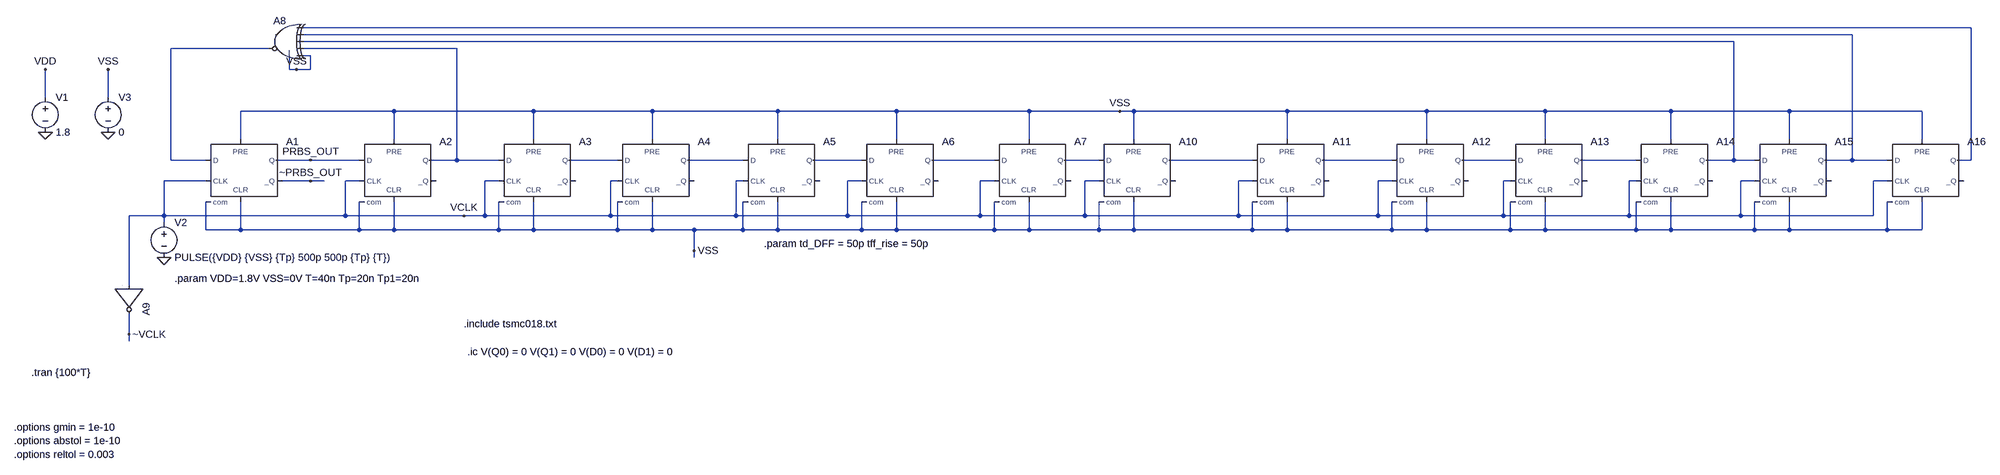
[diagram p0: schematic PRBS14bit.asc]
PRBS14bit.asc, the LTspice schematic file:
Version 4
SHEET 1 3508 752
WIRE 2880 -256 -944 -256
WIRE 2608 -240 -944 -240
WIRE 2336 -224 -944 -224
WIRE -1024 -208 -1248 -208
WIRE -592 -208 -944 -208
WIRE -928 -192 -944 -192
WIRE -976 -160 -976 -192
WIRE -960 -160 -976 -160
WIRE -928 -160 -928 -192
WIRE -928 -160 -960 -160
WIRE -1536 -96 -1536 -160
WIRE -1392 -96 -1392 -160
WIRE -736 -64 -1088 -64
WIRE -416 -64 -736 -64
WIRE -144 -64 -416 -64
WIRE 144 -64 -144 -64
WIRE 416 -64 144 -64
WIRE 720 -64 416 -64
WIRE 928 -64 720 -64
WIRE 960 -64 928 -64
WIRE 1312 -64 960 -64
WIRE 1632 -64 1312 -64
WIRE 1904 -64 1632 -64
WIRE 2192 -64 1904 -64
WIRE 2464 -64 2192 -64
WIRE 2768 -64 2464 -64
WIRE -1088 0 -1088 -64
WIRE -736 0 -736 -64
WIRE -416 0 -416 -64
WIRE -144 0 -144 -64
WIRE 144 0 144 -64
WIRE 416 0 416 -64
WIRE 720 0 720 -64
WIRE 960 0 960 -64
WIRE 1312 0 1312 -64
WIRE 1632 0 1632 -64
WIRE 1904 0 1904 -64
WIRE 2192 0 2192 -64
WIRE 2464 0 2464 -64
WIRE 2768 0 2768 -64
WIRE -1248 48 -1248 -208
WIRE -1168 48 -1248 48
WIRE -928 48 -1008 48
WIRE -816 48 -928 48
WIRE -592 48 -592 -208
WIRE -592 48 -656 48
WIRE -496 48 -592 48
WIRE -224 48 -336 48
WIRE 64 48 -64 48
WIRE 336 48 224 48
WIRE 640 48 496 48
WIRE 880 48 800 48
WIRE 1232 48 1040 48
WIRE 1552 48 1392 48
WIRE 1824 48 1712 48
WIRE 2112 48 1984 48
WIRE 2336 48 2336 -224
WIRE 2336 48 2272 48
WIRE 2384 48 2336 48
WIRE 2608 48 2608 -240
WIRE 2608 48 2544 48
WIRE 2688 48 2608 48
WIRE 2880 48 2880 -256
WIRE 2880 48 2848 48
WIRE -1168 96 -1264 96
WIRE -928 96 -992 96
WIRE -896 96 -928 96
WIRE -816 96 -848 96
WIRE -496 96 -528 96
WIRE -224 96 -240 96
WIRE 64 96 48 96
WIRE 336 96 304 96
WIRE 640 96 608 96
WIRE 880 96 848 96
WIRE 1232 96 1200 96
WIRE 1552 96 1520 96
WIRE 1824 96 1808 96
WIRE 2112 96 2096 96
WIRE 2384 96 2352 96
WIRE 2688 96 2656 96
WIRE -1264 176 -1264 96
WIRE -1264 176 -1344 176
WIRE -848 176 -848 96
WIRE -848 176 -1264 176
WIRE -576 176 -848 176
WIRE -528 176 -528 96
WIRE -528 176 -576 176
WIRE -240 176 -240 96
WIRE -240 176 -528 176
WIRE 48 176 48 96
WIRE 48 176 -240 176
WIRE 304 176 304 96
WIRE 304 176 48 176
WIRE 608 176 608 96
WIRE 608 176 304 176
WIRE 848 176 848 96
WIRE 848 176 608 176
WIRE 1200 176 1200 96
WIRE 1200 176 848 176
WIRE 1520 176 1520 96
WIRE 1520 176 1200 176
WIRE 1808 176 1808 96
WIRE 1808 176 1520 176
WIRE 2096 176 2096 96
WIRE 2096 176 1808 176
WIRE 2352 176 2352 96
WIRE 2352 176 2096 176
WIRE 2656 176 2656 96
WIRE 2656 176 2352 176
WIRE -1264 192 -1264 176
WIRE -1168 208 -1168 144
WIRE -1088 208 -1088 144
WIRE -1088 208 -1168 208
WIRE -816 208 -816 144
WIRE -816 208 -1088 208
WIRE -736 208 -736 144
WIRE -736 208 -816 208
WIRE -496 208 -496 144
WIRE -496 208 -736 208
WIRE -416 208 -416 144
WIRE -416 208 -496 208
WIRE -224 208 -224 144
WIRE -224 208 -416 208
WIRE -144 208 -144 144
WIRE -144 208 -224 208
WIRE -48 208 -144 208
WIRE 64 208 64 144
WIRE 64 208 -48 208
WIRE 144 208 144 144
WIRE 144 208 64 208
WIRE 336 208 336 144
WIRE 336 208 144 208
WIRE 416 208 416 144
WIRE 416 208 336 208
WIRE 640 208 640 144
WIRE 640 208 416 208
WIRE 720 208 720 144
WIRE 720 208 640 208
WIRE 880 208 880 144
WIRE 880 208 720 208
WIRE 960 208 960 144
WIRE 960 208 880 208
WIRE 1232 208 1232 144
WIRE 1232 208 960 208
WIRE 1312 208 1312 144
WIRE 1312 208 1232 208
WIRE 1552 208 1552 144
WIRE 1552 208 1312 208
WIRE 1632 208 1632 144
WIRE 1632 208 1552 208
WIRE 1824 208 1824 144
WIRE 1824 208 1632 208
WIRE 1904 208 1904 144
WIRE 1904 208 1824 208
WIRE 2112 208 2112 144
WIRE 2112 208 1904 208
WIRE 2192 208 2192 144
WIRE 2192 208 2112 208
WIRE 2384 208 2384 144
WIRE 2384 208 2192 208
WIRE 2464 208 2464 144
WIRE 2464 208 2384 208
WIRE 2688 208 2688 144
WIRE 2688 208 2464 208
WIRE 2768 208 2768 144
WIRE 2768 208 2688 208
WIRE -48 256 -48 208
WIRE -48 272 -48 256
WIRE -1344 336 -1344 176
WIRE -1344 448 -1344 400
WIRE -1344 464 -1344 448
FLAG -1536 -16 0
FLAG -1536 -160 VDD
FLAG -1264 272 0
FLAG -960 -160 VSS
FLAG -48 256 VSS
FLAG -928 48 PRBS_OUT
FLAG -928 96 ~PRBS_OUT
FLAG 928 -64 VSS
FLAG -576 176 VCLK
FLAG -1344 448 ~VCLK
FLAG -1392 -16 0
FLAG -1392 -160 VSS
SYMBOL voltage -1536 -112 R0
WINDOW 123 0 0 Left 0
WINDOW 39 0 0 Left 0
SYMATTR InstName V1
SYMATTR Value 1.8
SYMBOL Digital\\dflop -1088 0 R0
SYMATTR InstName A1
SYMATTR SpiceLine Trise = {tff_rise} Tfall = {tff_rise} Td = {td_DFF}
SYMATTR Value2 Vhigh = 1.8 Vlow = 0
SYMBOL Digital\\dflop -736 0 R0
SYMATTR InstName A2
SYMATTR SpiceLine Trise = {tff_rise} Tfall = {tff_rise} Td = {td_DFF}
SYMATTR Value2 Vhigh = 1.8 Vlow = 0
SYMBOL Digital\\dflop -416 0 R0
SYMATTR InstName A3
SYMATTR SpiceLine Trise = {tff_rise} Tfall = {tff_rise} Td = {td_DFF}
SYMATTR Value2 Vhigh = 1.8 Vlow = 0
SYMBOL Digital\\dflop -144 0 R0
SYMATTR InstName A4
SYMATTR SpiceLine Trise = {tff_rise} Tfall = {tff_rise} Td = {td_DFF}
SYMATTR Value2 Vhigh = 1.8 Vlow = 0
SYMBOL Digital\\dflop 144 0 R0
SYMATTR InstName A5
SYMATTR SpiceLine Trise = {tff_rise} Tfall = {tff_rise} Td = {td_DFF}
SYMATTR Value2 Vhigh = 1.8 Vlow = 0
SYMBOL Digital\\dflop 416 0 R0
SYMATTR InstName A6
SYMATTR SpiceLine Trise = {tff_rise} Tfall = {tff_rise} Td = {td_DFF}
SYMATTR Value2 Vhigh = 1.8 Vlow = 0
SYMBOL Digital\\dflop 720 0 R0
SYMATTR InstName A7
SYMATTR SpiceLine Trise = {tff_rise} Tfall = {tff_rise} Td = {td_DFF}
SYMATTR Value2 Vhigh = 1.8 Vlow = 0
SYMBOL Digital\\xor -992 -288 M0
SYMATTR InstName A8
SYMATTR Value2 Vhigh = 1.8 Vlow = 0
SYMATTR SpiceLine Trise = {tff_rise} Tfall = {tff_rise} Td = {td_DFF}
SYMBOL voltage -1264 176 R0
WINDOW 123 0 0 Left 0
WINDOW 39 0 0 Left 0
SYMATTR InstName V2
SYMATTR Value PULSE({VDD} {VSS} {Tp} 500p 500p {Tp} {T})
SYMBOL Digital\\inv -1280 336 R90
SYMATTR InstName A9
SYMATTR Value2 Vhigh = 1.8 Vlow = 0
SYMATTR SpiceLine Trise = {tff_rise} Tfall = {tff_rise} Td = {td_DFF}
SYMBOL voltage -1392 -112 R0
WINDOW 123 0 0 Left 0
WINDOW 39 0 0 Left 0
SYMATTR InstName V3
SYMATTR Value 0
SYMBOL Digital\\dflop 960 0 R0
SYMATTR InstName A10
SYMATTR SpiceLine Trise = {tff_rise} Tfall = {tff_rise} Td = {td_DFF}
SYMATTR Value2 Vhigh = 1.8 Vlow = 0
SYMBOL Digital\\dflop 1312 0 R0
SYMATTR InstName A11
SYMATTR SpiceLine Trise = {tff_rise} Tfall = {tff_rise} Td = {td_DFF}
SYMATTR Value2 Vhigh = 1.8 Vlow = 0
SYMBOL Digital\\dflop 1632 0 R0
SYMATTR InstName A12
SYMATTR SpiceLine Trise = {tff_rise} Tfall = {tff_rise} Td = {td_DFF}
SYMATTR Value2 Vhigh = 1.8 Vlow = 0
SYMBOL Digital\\dflop 1904 0 R0
SYMATTR InstName A13
SYMATTR SpiceLine Trise = {tff_rise} Tfall = {tff_rise} Td = {td_DFF}
SYMATTR Value2 Vhigh = 1.8 Vlow = 0
SYMBOL Digital\\dflop 2192 0 R0
SYMATTR InstName A14
SYMATTR SpiceLine Trise = {tff_rise} Tfall = {tff_rise} Td = {td_DFF}
SYMATTR Value2 Vhigh = 1.8 Vlow = 0
SYMBOL Digital\\dflop 2464 0 R0
SYMATTR InstName A15
SYMATTR SpiceLine Trise = {tff_rise} Tfall = {tff_rise} Td = {td_DFF}
SYMATTR Value2 Vhigh = 1.8 Vlow = 0
SYMBOL Digital\\dflop 2768 0 R0
SYMATTR InstName A16
SYMATTR SpiceLine Trise = {tff_rise} Tfall = {tff_rise} Td = {td_DFF}
SYMATTR Value2 Vhigh = 1.8 Vlow = 0
TEXT -576 424 Left 2 !.include tsmc018.txt
TEXT 112 240 Left 2 !.param td_DFF = 50p tff_rise = 50p
TEXT -1240 320 Left 2 !.param VDD=1.8V VSS=0V T=40n Tp=20n Tp1=20n
TEXT -1568 536 Left 2 !.tran {100*T}
TEXT -1608 680 Left 2 !.options gmin = 1e-10\n.options abstol = 1e-10\n.options reltol = 0.003
TEXT -568 488 Left 2 !.ic V(Q0) = 0 V(Q1) = 0 V(D0) = 0 V(D1) = 0

The netlist it stands for:
* PRBS14bit.asc
V1 VDD 0 1.8
A1 N004 VSS VCLK VSS VSS ~PRBS_OUT PRBS_OUT VSS DFLOP Vhigh = 1.8 Vlow = 0 Trise = {tff_rise} Tfall = {tff_rise} Td = {td_DFF}
A2 PRBS_OUT VSS VCLK VSS VSS VSS N005 VSS DFLOP Vhigh = 1.8 Vlow = 0 Trise = {tff_rise} Tfall = {tff_rise} Td = {td_DFF}
A3 N005 VSS VCLK VSS VSS VSS N006 VSS DFLOP Vhigh = 1.8 Vlow = 0 Trise = {tff_rise} Tfall = {tff_rise} Td = {td_DFF}
A4 N006 VSS VCLK VSS VSS VSS N007 VSS DFLOP Vhigh = 1.8 Vlow = 0 Trise = {tff_rise} Tfall = {tff_rise} Td = {td_DFF}
A5 N007 VSS VCLK VSS VSS VSS N008 VSS DFLOP Vhigh = 1.8 Vlow = 0 Trise = {tff_rise} Tfall = {tff_rise} Td = {td_DFF}
A6 N008 VSS VCLK VSS VSS VSS N009 VSS DFLOP Vhigh = 1.8 Vlow = 0 Trise = {tff_rise} Tfall = {tff_rise} Td = {td_DFF}
A7 N009 VSS VCLK VSS VSS VSS N010 VSS DFLOP Vhigh = 1.8 Vlow = 0 Trise = {tff_rise} Tfall = {tff_rise} Td = {td_DFF}
A8 N001 N002 N003 N005 VSS N004 VSS VSS XOR Vhigh = 1.8 Vlow = 0 Trise = {tff_rise} Tfall = {tff_rise} Td = {td_DFF}
V2 VCLK 0 PULSE({VDD} {VSS} {Tp} 500p 500p {Tp} {T})
A9 VCLK 0 0 0 0 ~VCLK 0 0 BUF Vhigh = 1.8 Vlow = 0 Trise = {tff_rise} Tfall = {tff_rise} Td = {td_DFF}
V3 VSS 0 0
A10 N010 VSS VCLK VSS VSS VSS N011 VSS DFLOP Vhigh = 1.8 Vlow = 0 Trise = {tff_rise} Tfall = {tff_rise} Td = {td_DFF}
A11 N011 VSS VCLK VSS VSS VSS N012 VSS DFLOP Vhigh = 1.8 Vlow = 0 Trise = {tff_rise} Tfall = {tff_rise} Td = {td_DFF}
A12 N012 VSS VCLK VSS VSS VSS N013 VSS DFLOP Vhigh = 1.8 Vlow = 0 Trise = {tff_rise} Tfall = {tff_rise} Td = {td_DFF}
A13 N013 VSS VCLK VSS VSS VSS N014 VSS DFLOP Vhigh = 1.8 Vlow = 0 Trise = {tff_rise} Tfall = {tff_rise} Td = {td_DFF}
A14 N014 VSS VCLK VSS VSS VSS N003 VSS DFLOP Vhigh = 1.8 Vlow = 0 Trise = {tff_rise} Tfall = {tff_rise} Td = {td_DFF}
A15 N003 VSS VCLK VSS VSS VSS N002 VSS DFLOP Vhigh = 1.8 Vlow = 0 Trise = {tff_rise} Tfall = {tff_rise} Td = {td_DFF}
A16 N002 VSS VCLK VSS VSS VSS N001 VSS DFLOP Vhigh = 1.8 Vlow = 0 Trise = {tff_rise} Tfall = {tff_rise} Td = {td_DFF}
.include tsmc018.txt
.param td_DFF = 50p tff_rise = 50p
.param VDD=1.8V VSS=0V T=40n Tp=20n Tp1=20n
.tran {100*T}
.options gmin = 1e-10
.options abstol = 1e-10
.options reltol = 0.003
.ic V(Q0) = 0 V(Q1) = 0 V(D0) = 0 V(D1) = 0
.backanno
.end